# EAGLE schematic main_v2 (EAGLE 6.3)
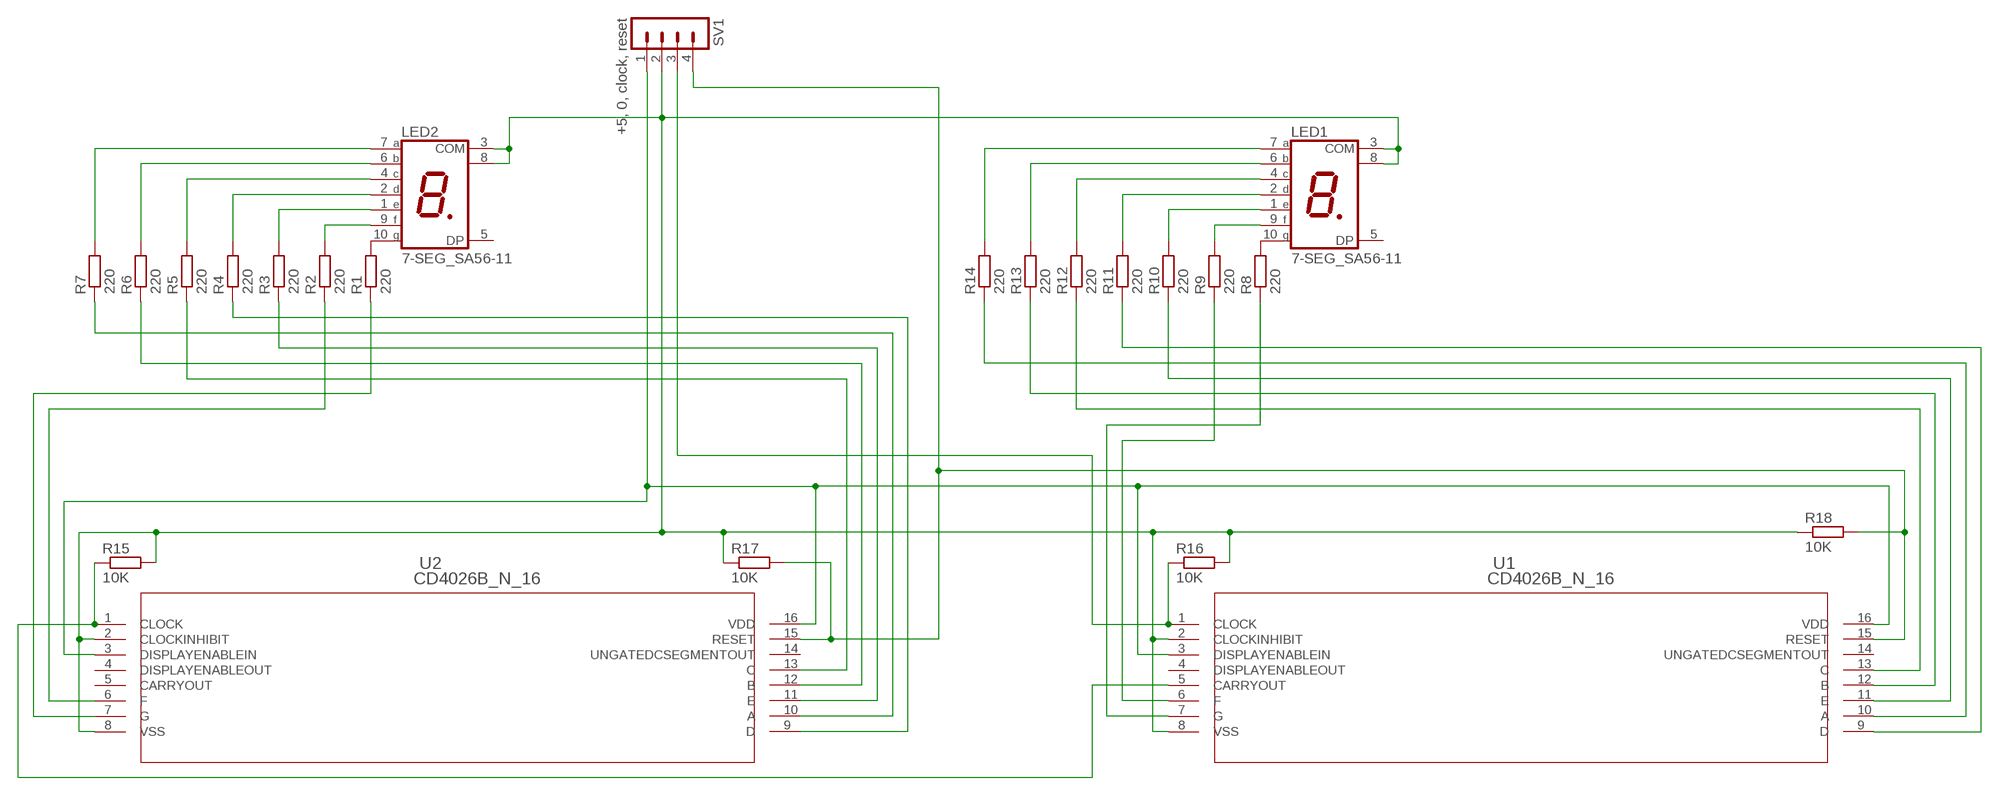
[diagram p0: schematic, sheet 1]

## Parts
LED1  7-SEG_SA56-11  [SA56-11]
LED2  7-SEG_SA56-11  [SA56-11]
R1  220  R-EU_R0805  [R0805]
R2  220  R-EU_R0805  [R0805]
R3  220  R-EU_R0805  [R0805]
R4  220  R-EU_R0805  [R0805]
R5  220  R-EU_R0805  [R0805]
R6  220  R-EU_R0805  [R0805]
R7  220  R-EU_R0805  [R0805]
R8  220  R-EU_R0805  [R0805]
R9  220  R-EU_R0805  [R0805]
R10  220  R-EU_R0805  [R0805]
R11  220  R-EU_R0805  [R0805]
R12  220  R-EU_R0805  [R0805]
R13  220  R-EU_R0805  [R0805]
R14  220  R-EU_R0805  [R0805]
R15  10K  R-EU_R0805  [R0805]
R16  10K  R-EU_R0805  [R0805]
R17  10K  R-EU_R0805  [R0805]
R18  10K  R-EU_R0805  [R0805]
SV1  +5, 0, clock, reset  MA04-1  [MA04-1]
U1  CD4026B_N_16  [N16]
U2  CD4026B_N_16  [N16]

## Nets
N$1: LED2.10(G) R1.2
N$2: LED2.9(F) R2.2
N$3: LED2.1(E) R3.2
N$4: LED2.2(D) R4.2
N$5: LED2.4(C) R5.2
N$6: LED2.6(B) R6.2
N$7: LED2.7(A) R7.2
N$8: SV1.1 U1.3(DISPLAYENABLEIN) U1.16(VDD) U2.3(DISPLAYENABLEIN) U2.16(VDD)
N$9: LED1.3(COM) LED1.8(COM) LED2.3(COM) LED2.8(COM) R15.2 R16.2 R17.1 R18.1 SV1.2 U1.2(CLOCKINHIBIT) U1.8(VSS) U2.2(CLOCKINHIBIT) U2.8(VSS)
N$10: LED1.10(G) R8.2
N$11: LED1.9(F) R9.2
N$12: LED1.1(E) R10.2
N$13: LED1.2(D) R11.2
N$14: LED1.4(C) R12.2
N$15: LED1.6(B) R13.2
N$16: LED1.7(A) R14.2
N$17: R16.1 SV1.3 U1.1(CLOCK)
N$18: R7.1 U2.10(A)
N$19: R6.1 U2.12(B)
N$21: R5.1 U2.13(C)
N$22: R4.1 U2.9(D)
N$23: R3.1 U2.11(E)
N$24: R2.1 U2.6(F)
N$25: R1.1 U2.7(G)
N$26: R17.2 R18.2 SV1.4 U1.15(RESET) U2.15(RESET)
N$27: R15.1 U1.5(CARRYOUT) U2.1(CLOCK)
N$28: R9.1 U1.6(F)
N$29: R8.1 U1.7(G)
N$30: R12.1 U1.13(C)
N$31: R13.1 U1.12(B)
N$32: R10.1 U1.11(E)
N$33: R14.1 U1.10(A)
N$34: R11.1 U1.9(D)
Unconnected: LED1.5(DP) LED2.5(DP) U1.4(DISPLAYENABLEOUT) U1.14(UNGATEDCSEGMENTOUT) U2.4(DISPLAYENABLEOUT) U2.5(CARRYOUT) U2.14(UNGATEDCSEGMENTOUT)

## Library data of the parts
LED1 LED2 = display-kingbright:7-SEG_: Kingbright 14.2mm (0.56 INCH) SINGLE DIGIT NUMERIC DUISPLAY Source: SA56-11EWA(Ver1189471036.pdf; OC_FARNELL: unknown; OC_NEWARK: unknown
R1-R18 = resistor:R-EU_: RESISTOR, European symbol
SV1 = con-lstb:MA04-1: PIN HEADER; OC_FARNELL: unknown; OC_NEWARK: unknown
U1 U2 = CD4026:CD4026B_N_16; DATASHEETURL: http://www.ti.com/lit/gpn/CD4026B; DESCRIPTION: CMOS Decade Counter/Divider with Decoded 7-Segment Display Outputs and Display Enable; FAMILY_NAME: DECADE COUNTER; GENERIC_PART_NUMBER: CD4026B; INDUSTRY_STD_PKG_TYPE: PDIP; MANUFACTURER: Texas Instruments; PACKAGE_DESIGNATOR: N; PIN_COUNT: 16